# EAGLE design PinkReq (EAGLE 9.5.2)
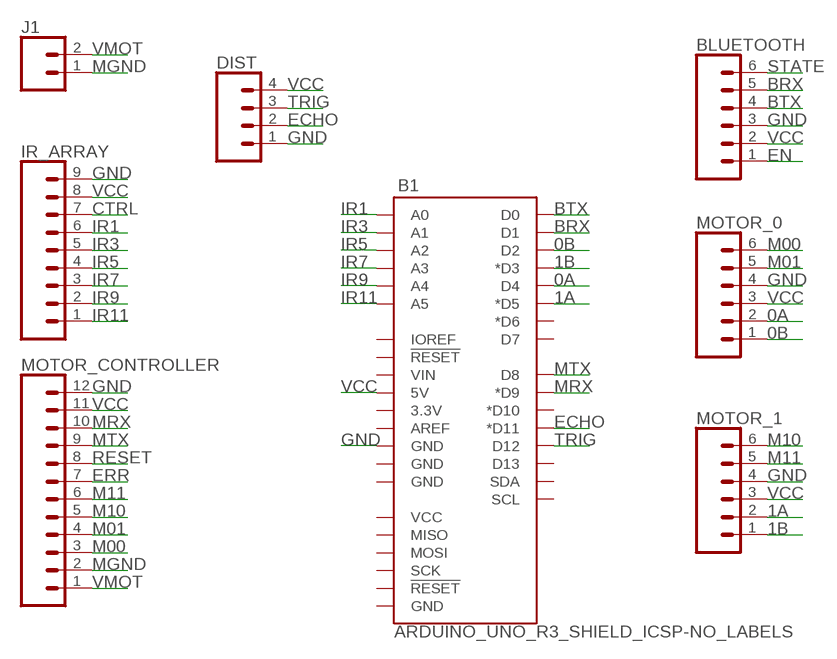
[diagram p0: schematic, sheet 1]

## Parts
B1  ARDUINO_UNO_R3_SHIELD_ICSP-NO_LABELS  [UNO_R3_SHIELD_ICSP_NOLABELS]
BLUETOOTH  CONN_06FEMALE_LOCK  [1X06_FEMALE_LOCK.010]
DIST  CONN_04LOCK  [1X04_LOCK]
IR_ARRAY  CONN_09LOCK  [1X09_LOCK]
J1  CONN_025MM  [SCREWTERMINAL-5MM-2]
MOTOR_0  CONN_06FEMALE_LOCK  [1X06_FEMALE_LOCK.010]
MOTOR_1  CONN_06FEMALE_LOCK  [1X06_FEMALE_LOCK.010]
MOTOR_CONTROLLER  CONN_12LOCK  [1X12_LOCK]

## Nets
0A: B1.D4 MOTOR_0.2
0B: B1.D2 MOTOR_0.1
1A: B1.D5(*D5) MOTOR_1.2
1B: B1.D3(*D3) MOTOR_1.1
BRX: B1.TX(D1) BLUETOOTH.5
BTX: B1.RX(D0) BLUETOOTH.4
CTRL: IR_ARRAY.7
ECHO: B1.D11(*D11) DIST.2
EN: BLUETOOTH.1
ERR: MOTOR_CONTROLLER.7
GND: B1.GND@2(GND) BLUETOOTH.3 DIST.1 IR_ARRAY.9 MOTOR_0.4 MOTOR_1.4 MOTOR_CONTROLLER.12
IR1: B1.A0 IR_ARRAY.6
IR3: B1.A1 IR_ARRAY.5
IR5: B1.A2 IR_ARRAY.4
IR7: B1.A3 IR_ARRAY.3
IR9: B1.A4 IR_ARRAY.2
IR11: B1.A5 IR_ARRAY.1
M00: MOTOR_0.6 MOTOR_CONTROLLER.3
M01: MOTOR_0.5 MOTOR_CONTROLLER.4
M10: MOTOR_1.6 MOTOR_CONTROLLER.5
M11: MOTOR_1.5 MOTOR_CONTROLLER.6
MGND: J1.1 MOTOR_CONTROLLER.2
MRX: B1.D9(*D9) MOTOR_CONTROLLER.10
MTX: B1.D8 MOTOR_CONTROLLER.9
RESET: MOTOR_CONTROLLER.8
STATE: BLUETOOTH.6
TRIG: B1.D12 DIST.3
VCC: B1.5V BLUETOOTH.2 DIST.4 IR_ARRAY.8 MOTOR_0.3 MOTOR_1.3 MOTOR_CONTROLLER.11
VMOT: J1.2 MOTOR_CONTROLLER.1
Unconnected: B1.3.3V B1.5V_ICSP(VCC) B1.AREF B1.D6(*D6) B1.D7 B1.D10(*D10) B1.D13 B1.GND@0(GND) B1.GND@1(GND) B1.GND_ICSP(GND) B1.IOREF B1.MISO B1.MOSI B1.RES(!RESET!) B1.RST_ICSP(!RESET!) B1.SCK B1.SCL B1.SDA B1.VIN

## Library data of the parts
B1 = SparkFun-Boards:ARDUINO_UNO_R3_SHIELD_ICSP: Arduino R3 Shield Footprint with ICSP Header Includes pins for 6-pin (2x3) ICSP Header. Compatible with Leonardo boards that require SPI pin connections via this header. SparkFun Products: CryptoShield <https://www.sparkfun.com/products/13183> microSD Shield <https://www.sparkfun.com/products/12761> R3 Stackable Headers Kit <https://www.sparkfun.com/products/1417>
BLUETOOTH MOTOR_0 MOTOR_1 = SparkFun-Connectors:CONN_06: Multi connection point. Often used as Generic Header-pin footprint for 0.1 inch spaced/style header connections On any of the 0.1 inch spaced packages, you can populate with these: Break Away Headers - Straight <https://www.sparkfun.com/products/116> (PRT-00116) Break Away Male Headers - Right Angle <https://www.sparkfun.com/products/553> (PRT-00553) Female Headers <https://www.sparkfun.com/products/115> (PRT-00115) Break Away Headers - Machine Pin <https://www.sparkfun.com/products/117> (PRT-00117) Break Away Female Headers - Swiss Machine Pin <https://www.sparkfun.com/products/743> (PRT-00743) Arduino Stackable Header - 6 Pin <https://www.sparkfun.com/products/9280> (PRT-09280) For SCREWTERMINALS and SPRING TERMINALS visit here: Screw Terimnals on SparkFun.com <https://www.sparkfun.com/search/results?term=Screw+Terminals> (5mm/3.5mm/2.54mm spacing) This device is also useful as a general connection point to wire up your design to another part of your project. Our various solder wires solder well into these plated through hole pads. Hook-Up Wire - Assortment (Stranded, 22 AWG) <https://www.sparkfun.com/products/11375> (PRT-11375) Hook-Up Wire - Assortment (Solid Core, 22 AWG) <https://www.sparkfun.com/products/11367> (PRT-11367) View the entire wire category on our website here <https://www.sparkfun.com/categories/141>
DIST = SparkFun-Connectors:CONN_04: Multi connection point. Often used as Generic Header-pin footprint for 0.1 inch spaced/style header connections On any of the 0.1 inch spaced packages, you can populate with these: Break Away Headers - Straight <https://www.sparkfun.com/products/116> (PRT-00116) Break Away Male Headers - Right Angle <https://www.sparkfun.com/products/553> (PRT-00553) Female Headers <https://www.sparkfun.com/products/115> (PRT-00115) Break Away Headers - Machine Pin <https://www.sparkfun.com/products/117> (PRT-00117) Break Away Female Headers - Swiss Machine Pin <https://www.sparkfun.com/products/743> (PRT-00743) For SCREWTERMINALS and SPRING TERMINALS visit here: Screw Terimnals on SparkFun.com <https://www.sparkfun.com/search/results?term=Screw+Terminals> (5mm/3.5mm/2.54mm spacing) This device is also useful as a general connection point to wire up your design to another part of your project. Our various solder wires solder well into these plated through hole pads. Hook-Up Wire - Assortment (Stranded, 22 AWG) <https://www.sparkfun.com/products/11375> (PRT-11375) Hook-Up Wire - Assortment (Solid Core, 22 AWG) <https://www.sparkfun.com/products/11367> (PRT-11367) View the entire wire category on our website here <https://www.sparkfun.com/categories/141> Special notes: Molex polarized connector foot print use with SKU : PRT-08231 with associated crimp pins and housings. 1MM SMD Version SKU: PRT-10208; PROD_ID: CONN-09696
IR_ARRAY = SparkFun-Connectors:CONN_09: Multi connection point. Often used as Generic Header-pin footprint for 0.1 inch spaced/style header connections On any of the 0.1 inch spaced packages, you can populate with these: Break Away Headers - Straight <https://www.sparkfun.com/products/116> (PRT-00116) Break Away Male Headers - Right Angle <https://www.sparkfun.com/products/553> (PRT-00553) Female Headers <https://www.sparkfun.com/products/115> (PRT-00115) Break Away Headers - Machine Pin <https://www.sparkfun.com/products/117> (PRT-00117) Break Away Female Headers - Swiss Machine Pin <https://www.sparkfun.com/products/743> (PRT-00743) For SCREWTERMINALS and SPRING TERMINALS visit here: Screw Terimnals on SparkFun.com <https://www.sparkfun.com/search/results?term=Screw+Terminals> (5mm/3.5mm/2.54mm spacing) This device is also useful as a general connection point to wire up your design to another part of your project. Our various solder wires solder well into these plated through hole pads. Hook-Up Wire - Assortment (Stranded, 22 AWG) <https://www.sparkfun.com/products/11375> (PRT-11375) Hook-Up Wire - Assortment (Solid Core, 22 AWG) <https://www.sparkfun.com/products/11367> (PRT-11367) View the entire wire category on our website here <https://www.sparkfun.com/categories/141> Special notes: Molex polarized connector foot print use with SKU : PRT-08231 with associated crimp pins and housings. 1MM SMD Version SKU: PRT-10208 NOTES ON THE VARIANTS LOCK and LOCK_LONGPADS... This footprint was designed to help hold the alignment of a through-hole component (i.e. 6-pin header) while soldering it into place. You may notice that each hole has been shifted either up or down by 0.005 of an inch from it's more standard position (which is a perfectly straight line). This slight alteration caused the pins (the squares in the middle) to touch the edges of the holes. Because they are alternating, it causes a "brace" to hold the component in place. 0.005 has proven to be the perfect amount of "off-center" position when using our standard breakaway headers. Although looks a little odd when you look at the bare footprint, once you have a header in there, the alteration is very hard to notice. Also,if you push a header all the way into place, it is covered up entirely on the bottom side.
J1 = SparkFun-Connectors:CONN_02: Multi connection point. Often used as Generic Header-pin footprint for 0.1 inch spaced/style header connections On any of the 0.1 inch spaced packages, you can populate with these: Break Away Headers - Straight <https://www.sparkfun.com/products/116> (PRT-00116) Break Away Male Headers - Right Angle <https://www.sparkfun.com/products/553> (PRT-00553) Female Headers <https://www.sparkfun.com/products/115> (PRT-00115) Break Away Headers - Machine Pin <https://www.sparkfun.com/products/117> (PRT-00117) Break Away Female Headers - Swiss Machine Pin <https://www.sparkfun.com/products/743> (PRT-00743) For SCREWTERMINALS and SPRING TERMINALS visit here: Screw Terimnals on SparkFun.com <https://www.sparkfun.com/search/results?term=Screw+Terminals> (5mm/3.5mm/2.54mm spacing) This device is also useful as a general connection point to wire up your design to another part of your project. Our various solder wires solder well into these plated through hole pads. Hook-Up Wire - Assortment (Stranded, 22 AWG) <https://www.sparkfun.com/products/11375> (PRT-11375) Hook-Up Wire - Assortment (Solid Core, 22 AWG) <https://www.sparkfun.com/products/11367> (PRT-11367) View the entire wire category on our website here <https://www.sparkfun.com/categories/141> Special notes: Molex polarized connector foot print use with: PRT-08233 with associated crimp pins and housings. 2.54_SCREWTERM for use with PRT-10571. 3.5mm Screw Terminal footprints for PRT-08084 5mm Screw Terminal footprints for use with PRT-08432; SF_SKU: PRT-08432
MOTOR_CONTROLLER = SparkFun-Connectors:CONN_12: Multi connection point. Often used as Generic Header-pin footprint for 0.1 inch spaced/style header connections On any of the 0.1 inch spaced packages, you can populate with these: Break Away Headers - Straight <https://www.sparkfun.com/products/116> (PRT-00116) Break Away Male Headers - Right Angle <https://www.sparkfun.com/products/553> (PRT-00553) Female Headers <https://www.sparkfun.com/products/115> (PRT-00115) Break Away Headers - Machine Pin <https://www.sparkfun.com/products/117> (PRT-00117) Break Away Female Headers - Swiss Machine Pin <https://www.sparkfun.com/products/743> (PRT-00743) For SCREWTERMINALS and SPRING TERMINALS visit here: Screw Terimnals on SparkFun.com <https://www.sparkfun.com/search/results?term=Screw+Terminals> (5mm/3.5mm/2.54mm spacing) This device is also useful as a general connection point to wire up your design to another part of your project. Our various solder wires solder well into these plated through hole pads. Hook-Up Wire - Assortment (Stranded, 22 AWG) <https://www.sparkfun.com/products/11375> (PRT-11375) Hook-Up Wire - Assortment (Solid Core, 22 AWG) <https://www.sparkfun.com/products/11367> (PRT-11367) View the entire wire category on our website here <https://www.sparkfun.com/categories/141> Special notes: Molex polarized connector foot print use with SKU : PRT-08231 with associated crimp pins and housings. 1MM SMD Version SKU: PRT-10208 NOTES ON THE VARIANTS LOCK and LOCK_LONGPADS... This footprint was designed to help hold the alignment of a through-hole component (i.e. 6-pin header) while soldering it into place. You may notice that each hole has been shifted either up or down by 0.005 of an inch from it's more standard position (which is a perfectly straight line). This slight alteration caused the pins (the squares in the middle) to touch the edges of the holes. Because they are alternating, it causes a "brace" to hold the component in place. 0.005 has proven to be the perfect amount of "off-center" position when using our standard breakaway headers. Although looks a little odd when you look at the bare footprint, once you have a header in there, the alteration is very hard to notice. Also,if you push a header all the way into place, it is covered up entirely on the bottom side.

## Board
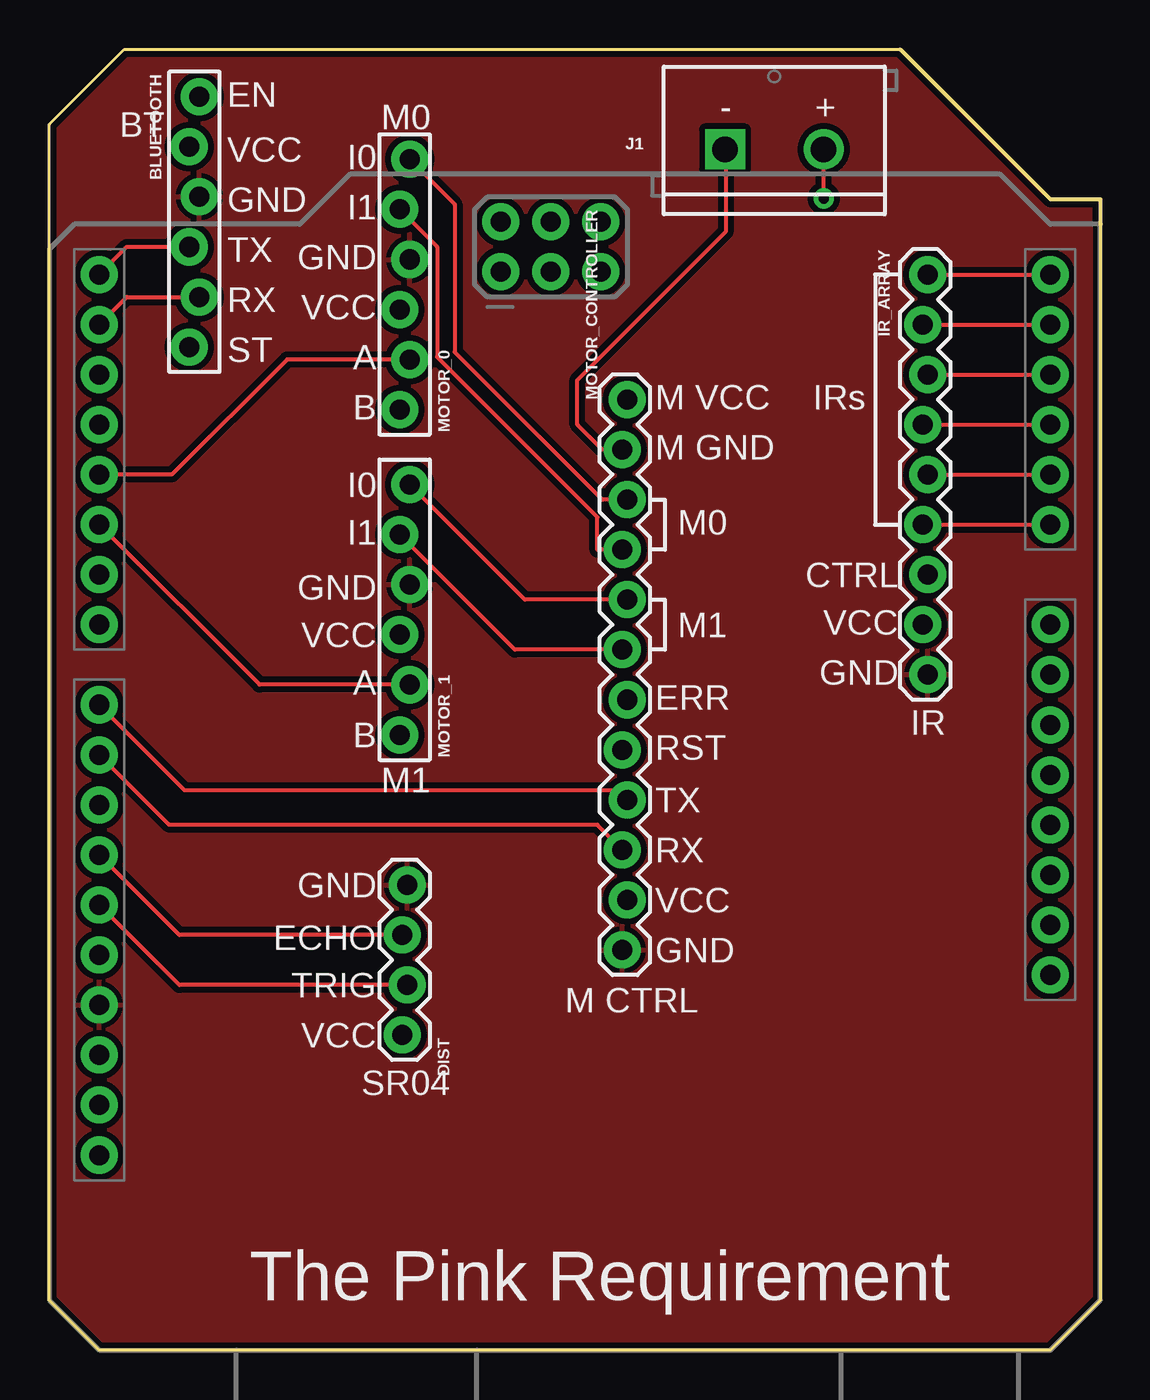
[diagram p1: board, top side]
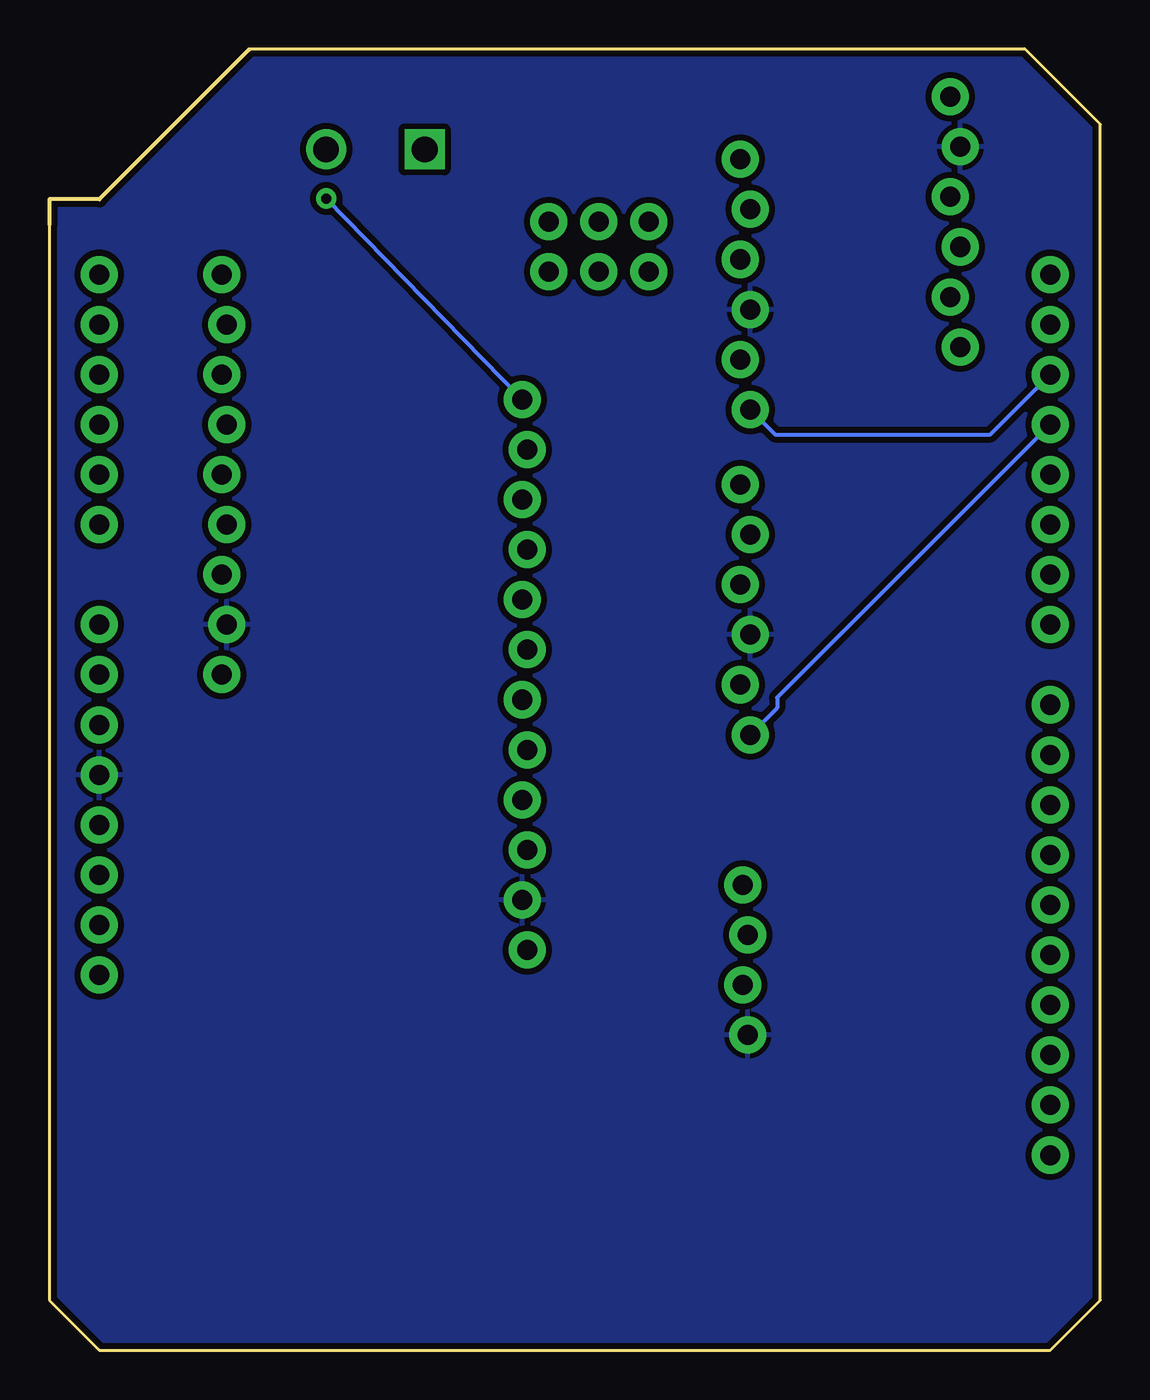
[diagram p2: board, bottom side, seen from below]

Size 53.34 x 66.04 mm. Coordinates in mm from the lower left corner, seen from the top.
Outline: 0,2.54 0,62.23 3.81,66.04 43.18,66.04 50.8,58.42 53.34,58.42 53.34,57.15 53.34,2.54 50.8,0 2.54,0 0,2.54
Copper layers (1*16): Top 0.035mm / dielectric 1.5mm / Bottom 0.035mm
Design rules "SparkFun": minimum track width 8mil, minimum drill 20mil, track to track 8mil, track to pad 8mil, pad to pad 8mil, via to via 8mil, smd to smd 8mil, copper to edge 8mil, drill to drill 8mil, minimum pad ring 12mil, minimum via ring 10mil, stop-mask expansion 4mil, vias tented up to drill 20mil, thermal gap 10mil

### Footprints (pad centres in the part's own frame; a part is rotated, then mirrored left to right if it is on the bottom)
UNO_R3_SHIELD_ICSP_NOLABELS = drill 1.016 pad 1.88: 3.3V 24.13,-3.81; 5V 24.13,-1.27; 5V_ICSP -3.76,26.81; A0 24.13,11.43; A1 24.13,13.97; A2 24.13,16.51; A3 24.13,19.05; A4 24.13,21.59; A5 24.13,24.13; AREF -24.13,-15.494; D2 -24.13,19.05; D3 -24.13,16.51; D4 -24.13,13.97; D5 -24.13,11.43; D6 -24.13,8.89; D7 -24.13,6.35; D8 -24.13,2.286; D9 -24.13,-0.254; D10 -24.13,-2.794; D11 -24.13,-5.334; D12 -24.13,-7.874; D13 -24.13,-10.414; GND@0 24.13,1.27; GND@1 24.13,3.81; GND@2 -24.13,-12.954; GND_ICSP 1.32,26.81; IOREF 24.13,-8.89; MISO -3.76,24.27; MOSI -1.22,26.81; NC 24.13,-11.43; RES 24.13,-6.35; RST_ICSP 1.32,24.27; RX -24.13,24.13; SCK -1.22,24.27; SCL -24.13,-20.574; SDA -24.13,-18.034; TX -24.13,21.59; VIN 24.13,6.35
1X06_FEMALE_LOCK.010 = drill 1.016 pad 1.88: 1 0,0.254; 2 2.54,-0.254; 3 5.08,0.254; 4 7.62,-0.254; 5 10.16,0.254; 6 12.7,-0.254
1X04_LOCK = drill 1.016 pad 1.88: 1 0,0.127; 2 2.54,-0.127; 3 5.08,0.127; 4 7.62,-0.127
1X09_LOCK = drill 1.016 pad 1.88: 1 0,0.127; 2 2.54,-0.127; 3 5.08,0.127; 4 7.62,-0.127; 5 10.16,0.127; 6 12.7,-0.127; 7 15.24,0.127; 8 17.78,-0.127; 9 20.32,0.127
SCREWTERMINAL-5MM-2 = drill 1.3 pad 2.032 square: 1 0,0 | drill 1.3 pad 2.032: 2 5,0
1X12_LOCK = drill 1.016 pad 1.88: 1 0,0.127; 2 2.54,-0.127; 3 5.08,0.127; 4 7.62,-0.127; 5 10.16,0.127; 6 12.7,-0.127; 7 15.24,0.127; 8 17.78,-0.127; 9 20.32,0.127; 10 22.86,-0.127; 11 25.4,0.127; 12 27.94,-0.127

### Placement (x,y rotation side)
B1  26.67,30.48 0 top
BLUETOOTH  7.37,63.63 270 top
DIST  18.03,23.62 270 top
IR_ARRAY  44.45,54.61 270 top
J1  34.29,60.96 0 top
MOTOR_0  18.03,47.75 90 top
MOTOR_1  18.03,31.24 90 top
MOTOR_CONTROLLER  29.21,48.26 270 top

### Tracks (layer width: path | path; a pad name or v marks a point on that pad's centre or on a via)
0A
  Top 0.203: MOTOR_0.2 12.06,50.29 6.22,44.45 B1.D4
0B
  Bottom 0.203: MOTOR_0.1 16.51,46.48 5.59,46.48 B1.D2
1A
  Top 0.203: B1.D5 10.67,33.78 MOTOR_1.2
1B
  Bottom 0.203: MOTOR_1.1 16.41,32.61 16.41,33.12 B1.D3
BRX
  Top 0.203: B1.TX 3.81,53.34 3.94,53.47 BLUETOOTH.5
BTX
  Top 0.203: B1.RX 3.94,56.01 BLUETOOTH.4
ECHO
  Top 0.203: DIST.2 6.6,21.08 B1.D11
GND
  pour Top (isolate 0.305, rank 2): 0,2.54 0,62.23 3.81,66.04 43.18,66.04 50.8,58.42 53.34,58.42 53.34,2.54 50.8,0 2.54,0
IR1
  Top 0.203: IR_ARRAY.6 B1.A0
IR3
  Top 0.203: IR_ARRAY.5 B1.A1
IR5
  Top 0.203: IR_ARRAY.4 B1.A2
IR7
  Top 0.203: IR_ARRAY.3 B1.A3
IR9
  Top 0.203: IR_ARRAY.2 B1.A4
IR11
  Top 0.203: IR_ARRAY.1 B1.A5
M00
  Top 0.203: MOTOR_0.6 20.57,58.17 20.57,50.67 28.07,43.18 MOTOR_CONTROLLER.3
M01
  Top 0.203: MOTOR_0.5 19.68,56.01 19.68,50.42 27.81,42.29 27.81,40.64 MOTOR_CONTROLLER.4
M10
  Top 0.203: MOTOR_CONTROLLER.5 24.13,38.1 MOTOR_1.6
M11
  Top 0.203: MOTOR_CONTROLLER.6 23.62,35.56 MOTOR_1.5
MGND
  Top 0.203: J1.1 34.31,60.94 34.31,56.77 26.8,49.26 26.8,46.99 28.07,45.72 MOTOR_CONTROLLER.2
MRX
  Top 0.203: B1.D9 6.1,26.67 27.81,26.67 MOTOR_CONTROLLER.10
MTX
  Top 0.203: B1.D8 6.88,28.42 28.85,28.42 MOTOR_CONTROLLER.9
TRIG
  Top 0.203: B1.D12 6.6,18.54 DIST.3
VCC
  pour Bottom (isolate 0.305): 0,2.54 0,62.23 3.81,66.04 43.18,66.04 50.8,58.42 53.34,58.42 53.34,2.54 50.8,0 2.54,0
VMOT  (via drill 0.51)
  Top 0.203: v39.29,58.47 J1.2
  Bottom 0.203: MOTOR_CONTROLLER.1 v39.29,58.47

### Text on the board
tPlace: EN | BT | M0 | - | + | VCC | I0 | GND | I1 | TX | GND | RX | VCC | ST | A | M VCC | IRs | B | M GND | I0 | I1 | M0 | CTRL | GND | VCC | M1 | VCC | GND | A | ERR | B | IR | RST | M1 | TX | RX | GND | VCC | ECHO | GND | TRIG | M CTRL | VCC | SR04 | The Pink Requirement